# EAGLE design P20 Relay Board V1 (EAGLE 9.5.0)

## Sheet 1 of 3
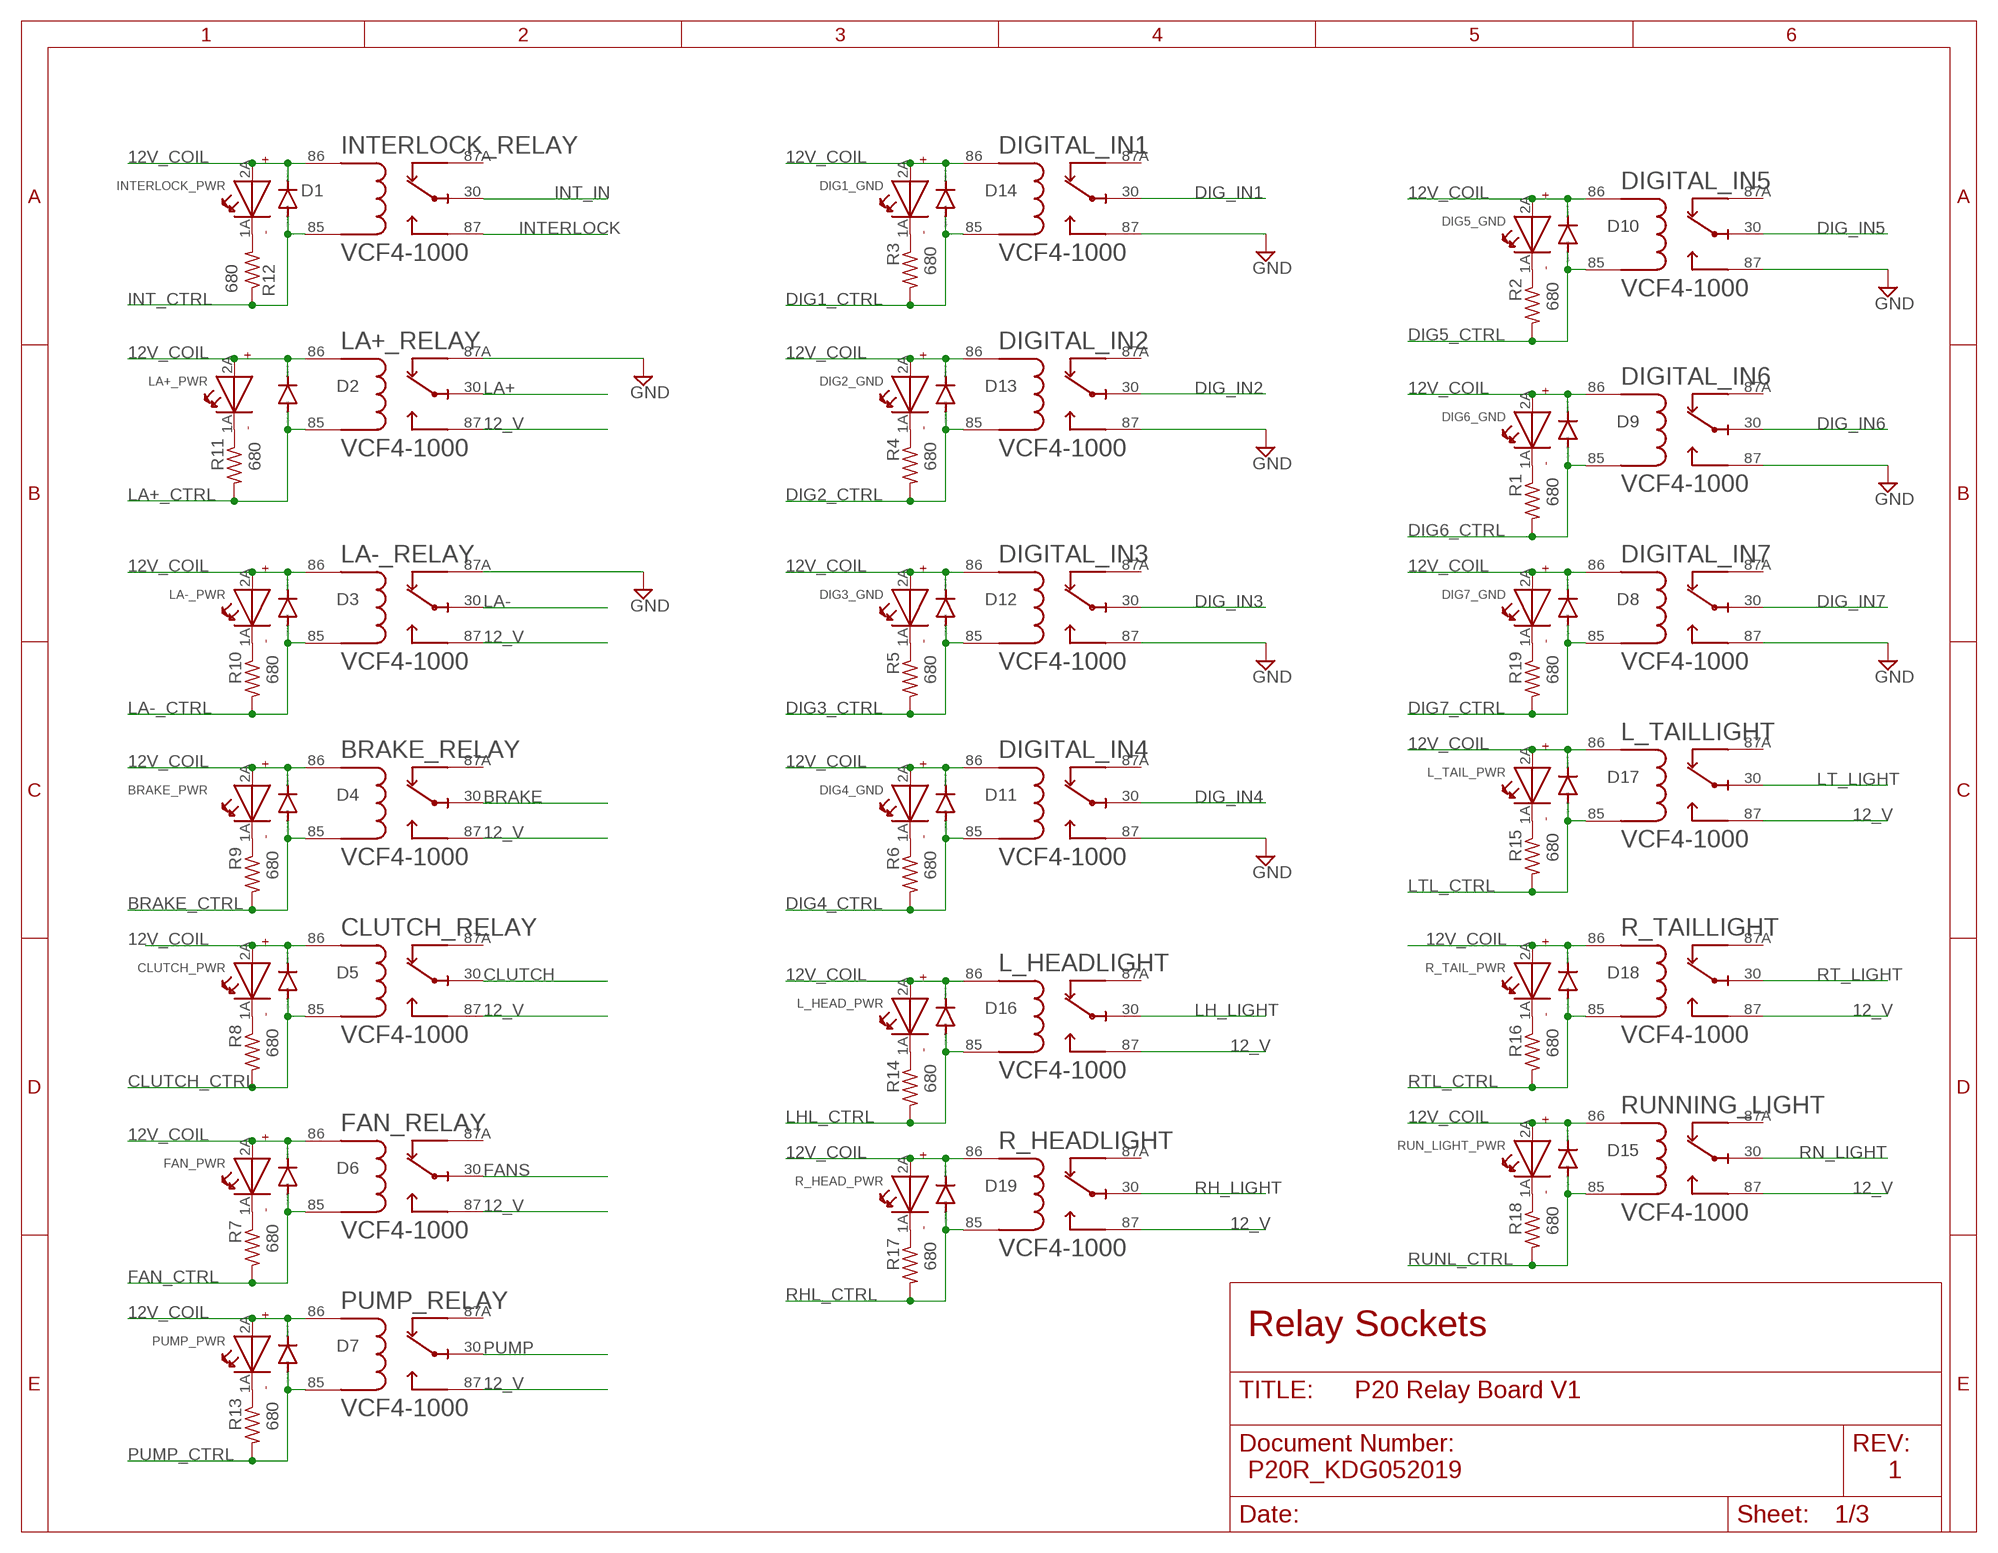
[diagram p0: schematic, sheet 1]

### Parts
BRAKE_PWR  WL-TMRW151033BS03000-B  [LED-3MM-ROUND]
BRAKE_RELAY  VCF4-1000  [TE_VCF4-1000]
CLUTCH_PWR  WL-TMRW151033BS03000-B  [LED-3MM-ROUND]
CLUTCH_RELAY  VCF4-1000  [TE_VCF4-1000]
D1  1N4004  [DO41-10]
D2  1N4004  [DO41-10]
D3  1N4004  [DO41-10]
D4  1N4004  [DO41-10]
D5  1N4004  [DO41-10]
D6  1N4004  [DO41-10]
D7  1N4004  [DO41-10]
D8  1N4004  [DO41-10]
D9  1N4004  [DO41-10]
D10  1N4004  [DO41-10]
D11  1N4004  [DO41-10]
D12  1N4004  [DO41-10]
D13  1N4004  [DO41-10]
D14  1N4004  [DO41-10]
D15  1N4004  [DO41-10]
D16  1N4004  [DO41-10]
D17  1N4004  [DO41-10]
D18  1N4004  [DO41-10]
D19  1N4004  [DO41-10]
DIG1_GND  WL-TMRW151033BS03000-B  [LED-3MM-ROUND]
DIG2_GND  WL-TMRW151033BS03000-B  [LED-3MM-ROUND]
DIG3_GND  WL-TMRW151033BS03000-B  [LED-3MM-ROUND]
DIG4_GND  WL-TMRW151033BS03000-B  [LED-3MM-ROUND]
DIG5_GND  WL-TMRW151033BS03000-B  [LED-3MM-ROUND]
DIG6_GND  WL-TMRW151033BS03000-B  [LED-3MM-ROUND]
DIG7_GND  WL-TMRW151033BS03000-B  [LED-3MM-ROUND]
DIGITAL_IN1  VCF4-1000  [TE_VCF4-1000]
DIGITAL_IN2  VCF4-1000  [TE_VCF4-1000]
DIGITAL_IN3  VCF4-1000  [TE_VCF4-1000]
DIGITAL_IN4  VCF4-1000  [TE_VCF4-1000]
DIGITAL_IN5  VCF4-1000  [TE_VCF4-1000]
DIGITAL_IN6  VCF4-1000  [TE_VCF4-1000]
DIGITAL_IN7  VCF4-1000  [TE_VCF4-1000]
FAN_PWR  WL-TMRW151033BS03000-B  [LED-3MM-ROUND]
FAN_RELAY  VCF4-1000  [TE_VCF4-1000]
INTERLOCK_PWR  WL-TMRW151033BS03000-B  [LED-3MM-ROUND]
INTERLOCK_RELAY  VCF4-1000  [TE_VCF4-1000]
L_HEAD_PWR  WL-TMRW151033BS03000-B  [LED-3MM-ROUND]
L_HEADLIGHT  VCF4-1000  [TE_VCF4-1000]
L_TAIL_PWR  WL-TMRW151033BS03000-B  [LED-3MM-ROUND]
L_TAILLIGHT  VCF4-1000  [TE_VCF4-1000]
LA+_PWR  WL-TMRW151033BS03000-B  [LED-3MM-ROUND]
LA+_RELAY  VCF4-1000  [TE_VCF4-1000]
LA-_PWR  WL-TMRW151033BS03000-B  [LED-3MM-ROUND]
LA-_RELAY  VCF4-1000  [TE_VCF4-1000]
PUMP_PWR  WL-TMRW151033BS03000-B  [LED-3MM-ROUND]
PUMP_RELAY  VCF4-1000  [TE_VCF4-1000]
R1  680  R-US_0207/10  [0207/10]
R2  680  R-US_0207/10  [0207/10]
R3  680  R-US_0207/10  [0207/10]
R4  680  R-US_0207/10  [0207/10]
R5  680  R-US_0207/10  [0207/10]
R6  680  R-US_0207/10  [0207/10]
R7  680  R-US_0207/10  [0207/10]
R8  680  R-US_0207/10  [0207/10]
R9  680  R-US_0207/10  [0207/10]
R10  680  R-US_0207/10  [0207/10]
R11  680  R-US_0207/10  [0207/10]
R12  680  R-US_0207/10  [0207/10]
R13  680  R-US_0207/10  [0207/10]
R14  680  R-US_0207/10  [0207/10]
R15  680  R-US_0207/10  [0207/10]
R16  680  R-US_0207/10  [0207/10]
R17  680  R-US_0207/10  [0207/10]
R18  680  R-US_0207/10  [0207/10]
R19  680  R-US_0207/10  [0207/10]
R_HEAD_PWR  WL-TMRW151033BS03000-B  [LED-3MM-ROUND]
R_HEADLIGHT  VCF4-1000  [TE_VCF4-1000]
R_TAIL_PWR  WL-TMRW151033BS03000-B  [LED-3MM-ROUND]
R_TAILLIGHT  VCF4-1000  [TE_VCF4-1000]
RUN_LIGHT_PWR  WL-TMRW151033BS03000-B  [LED-3MM-ROUND]
RUNNING_LIGHT  VCF4-1000  [TE_VCF4-1000]

### Nets
12_V: BRAKE_RELAY.87 CLUTCH_RELAY.87 FAN_RELAY.87 L_HEADLIGHT.87 L_TAILLIGHT.87 LA+_RELAY.87 LA-_RELAY.87 PUMP_RELAY.87 R_HEADLIGHT.87 R_TAILLIGHT.87 RUNNING_LIGHT.87 ; also sheet 2
12V_COIL: BRAKE_PWR.2A(+) BRAKE_RELAY.86 CLUTCH_PWR.2A(+) CLUTCH_RELAY.86 D1.C D2.C D3.C D4.C D5.C D6.C D7.C D8.C D9.C D10.C D11.C D12.C D13.C D14.C D15.C D16.C D17.C D18.C D19.C DIG1_GND.2A(+) DIG2_GND.2A(+) DIG3_GND.2A(+) DIG4_GND.2A(+) DIG5_GND.2A(+) DIG6_GND.2A(+) DIG7_GND.2A(+) DIGITAL_IN1.86 DIGITAL_IN2.86 DIGITAL_IN3.86 DIGITAL_IN4.86 DIGITAL_IN5.86 DIGITAL_IN6.86 DIGITAL_IN7.86 FAN_PWR.2A(+) FAN_RELAY.86 INTERLOCK_PWR.2A(+) INTERLOCK_RELAY.86 L_HEAD_PWR.2A(+) L_HEADLIGHT.86 L_TAIL_PWR.2A(+) L_TAILLIGHT.86 LA+_PWR.2A(+) LA+_RELAY.86 LA-_PWR.2A(+) LA-_RELAY.86 PUMP_PWR.2A(+) PUMP_RELAY.86 R_HEAD_PWR.2A(+) R_HEADLIGHT.86 R_TAIL_PWR.2A(+) R_TAILLIGHT.86 RUN_LIGHT_PWR.2A(+) RUNNING_LIGHT.86 ; also sheet 2
BRAKE: BRAKE_RELAY.30 ; also sheet 2
BRAKE_CTRL: BRAKE_RELAY.85 D4.A R9.2 ; also sheet 2
CLUTCH: CLUTCH_RELAY.30 ; also sheet 2
CLUTCH_CTRL: CLUTCH_RELAY.85 D5.A R8.2 ; also sheet 2
DIG1_CTRL: D14.A DIGITAL_IN1.85 R3.2 ; also sheet 2
DIG2_CTRL: D13.A DIGITAL_IN2.85 R4.2 ; also sheet 2
DIG3_CTRL: D12.A DIGITAL_IN3.85 R5.2 ; also sheet 2
DIG4_CTRL: D11.A DIGITAL_IN4.85 R6.2 ; also sheet 2
DIG5_CTRL: D10.A DIGITAL_IN5.85 R2.2 ; also sheet 2
DIG6_CTRL: D9.A DIGITAL_IN6.85 R1.2 ; also sheet 2
DIG7_CTRL: D8.A DIGITAL_IN7.85 R19.2 ; also sheet 2
DIG_IN1: DIGITAL_IN1.30 ; also sheet 2
DIG_IN2: DIGITAL_IN2.30 ; also sheet 2
DIG_IN3: DIGITAL_IN3.30 ; also sheet 2
DIG_IN4: DIGITAL_IN4.30 ; also sheet 2
DIG_IN5: DIGITAL_IN5.30 ; also sheet 2
DIG_IN6: DIGITAL_IN6.30 ; also sheet 2
DIG_IN7: DIGITAL_IN7.30 ; also sheet 2
FAN_CTRL: D6.A FAN_RELAY.85 R7.2 ; also sheet 2
FANS: FAN_RELAY.30 ; also sheet 2
GND: DIGITAL_IN1.87 DIGITAL_IN2.87 DIGITAL_IN3.87 DIGITAL_IN4.87 DIGITAL_IN5.87 DIGITAL_IN6.87 DIGITAL_IN7.87 LA+_RELAY.87A LA-_RELAY.87A ; also sheet 2
INT_CTRL: D1.A INTERLOCK_RELAY.85 R12.1 ; also sheet 2
INT_IN: INTERLOCK_RELAY.30 ; also sheet 2
INTERLOCK: INTERLOCK_RELAY.87 ; also sheet 2
LA+: LA+_RELAY.30 ; also sheet 2
LA+_CTRL: D2.A LA+_RELAY.85 R11.2 ; also sheet 2
LA-: LA-_RELAY.30 ; also sheet 2
LA-_CTRL: D3.A LA-_RELAY.85 R10.2 ; also sheet 2
LH_LIGHT: L_HEADLIGHT.30 ; also sheet 2
LHL_CTRL: D16.A L_HEADLIGHT.85 R14.2 ; also sheet 2
LT_LIGHT: L_TAILLIGHT.30 ; also sheet 2
LTL_CTRL: D17.A L_TAILLIGHT.85 R15.2 ; also sheet 2
N$2: DIG7_GND.1A(-) R19.1
N$4: DIG5_GND.1A(-) R2.1
N$5: DIG1_GND.1A(-) R3.1
N$6: DIG2_GND.1A(-) R4.1
N$7: DIG3_GND.1A(-) R5.1
N$8: DIG4_GND.1A(-) R6.1
N$9: FAN_PWR.1A(-) R7.1
N$10: CLUTCH_PWR.1A(-) R8.1
N$11: BRAKE_PWR.1A(-) R9.1
N$12: LA-_PWR.1A(-) R10.1
N$13: LA+_PWR.1A(-) R11.1
N$14: INTERLOCK_PWR.1A(-) R12.2
N$15: PUMP_PWR.1A(-) R13.1
N$16: L_HEAD_PWR.1A(-) R14.1
N$17: L_TAIL_PWR.1A(-) R15.1
N$19: R17.1 R_HEAD_PWR.1A(-)
N$33: R16.1 R_TAIL_PWR.1A(-)
N$34: R18.1 RUN_LIGHT_PWR.1A(-)
N$36: DIG6_GND.1A(-) R1.1
PUMP: PUMP_RELAY.30 ; also sheet 2
PUMP_CTRL: D7.A PUMP_RELAY.85 R13.2 ; also sheet 2
RH_LIGHT: R_HEADLIGHT.30 ; also sheet 2
RHL_CTRL: D19.A R17.2 R_HEADLIGHT.85 ; also sheet 2
RN_LIGHT: RUNNING_LIGHT.30 ; also sheet 2
RT_LIGHT: R_TAILLIGHT.30 ; also sheet 2
RTL_CTRL: D18.A R16.2 R_TAILLIGHT.85 ; also sheet 2
RUNL_CTRL: D15.A R18.2 RUNNING_LIGHT.85 ; also sheet 2
Unconnected: BRAKE_RELAY.87A CLUTCH_RELAY.87A DIGITAL_IN1.87A DIGITAL_IN2.87A DIGITAL_IN3.87A DIGITAL_IN4.87A DIGITAL_IN5.87A DIGITAL_IN6.87A DIGITAL_IN7.87A FAN_RELAY.87A INTERLOCK_RELAY.87A L_HEADLIGHT.87A L_TAILLIGHT.87A PUMP_RELAY.87A R_HEADLIGHT.87A R_TAILLIGHT.87A RUNNING_LIGHT.87A

### Notes on the sheet
- Relay Sockets
- P20R_KDG052019 | 1

## Sheet 2 of 3
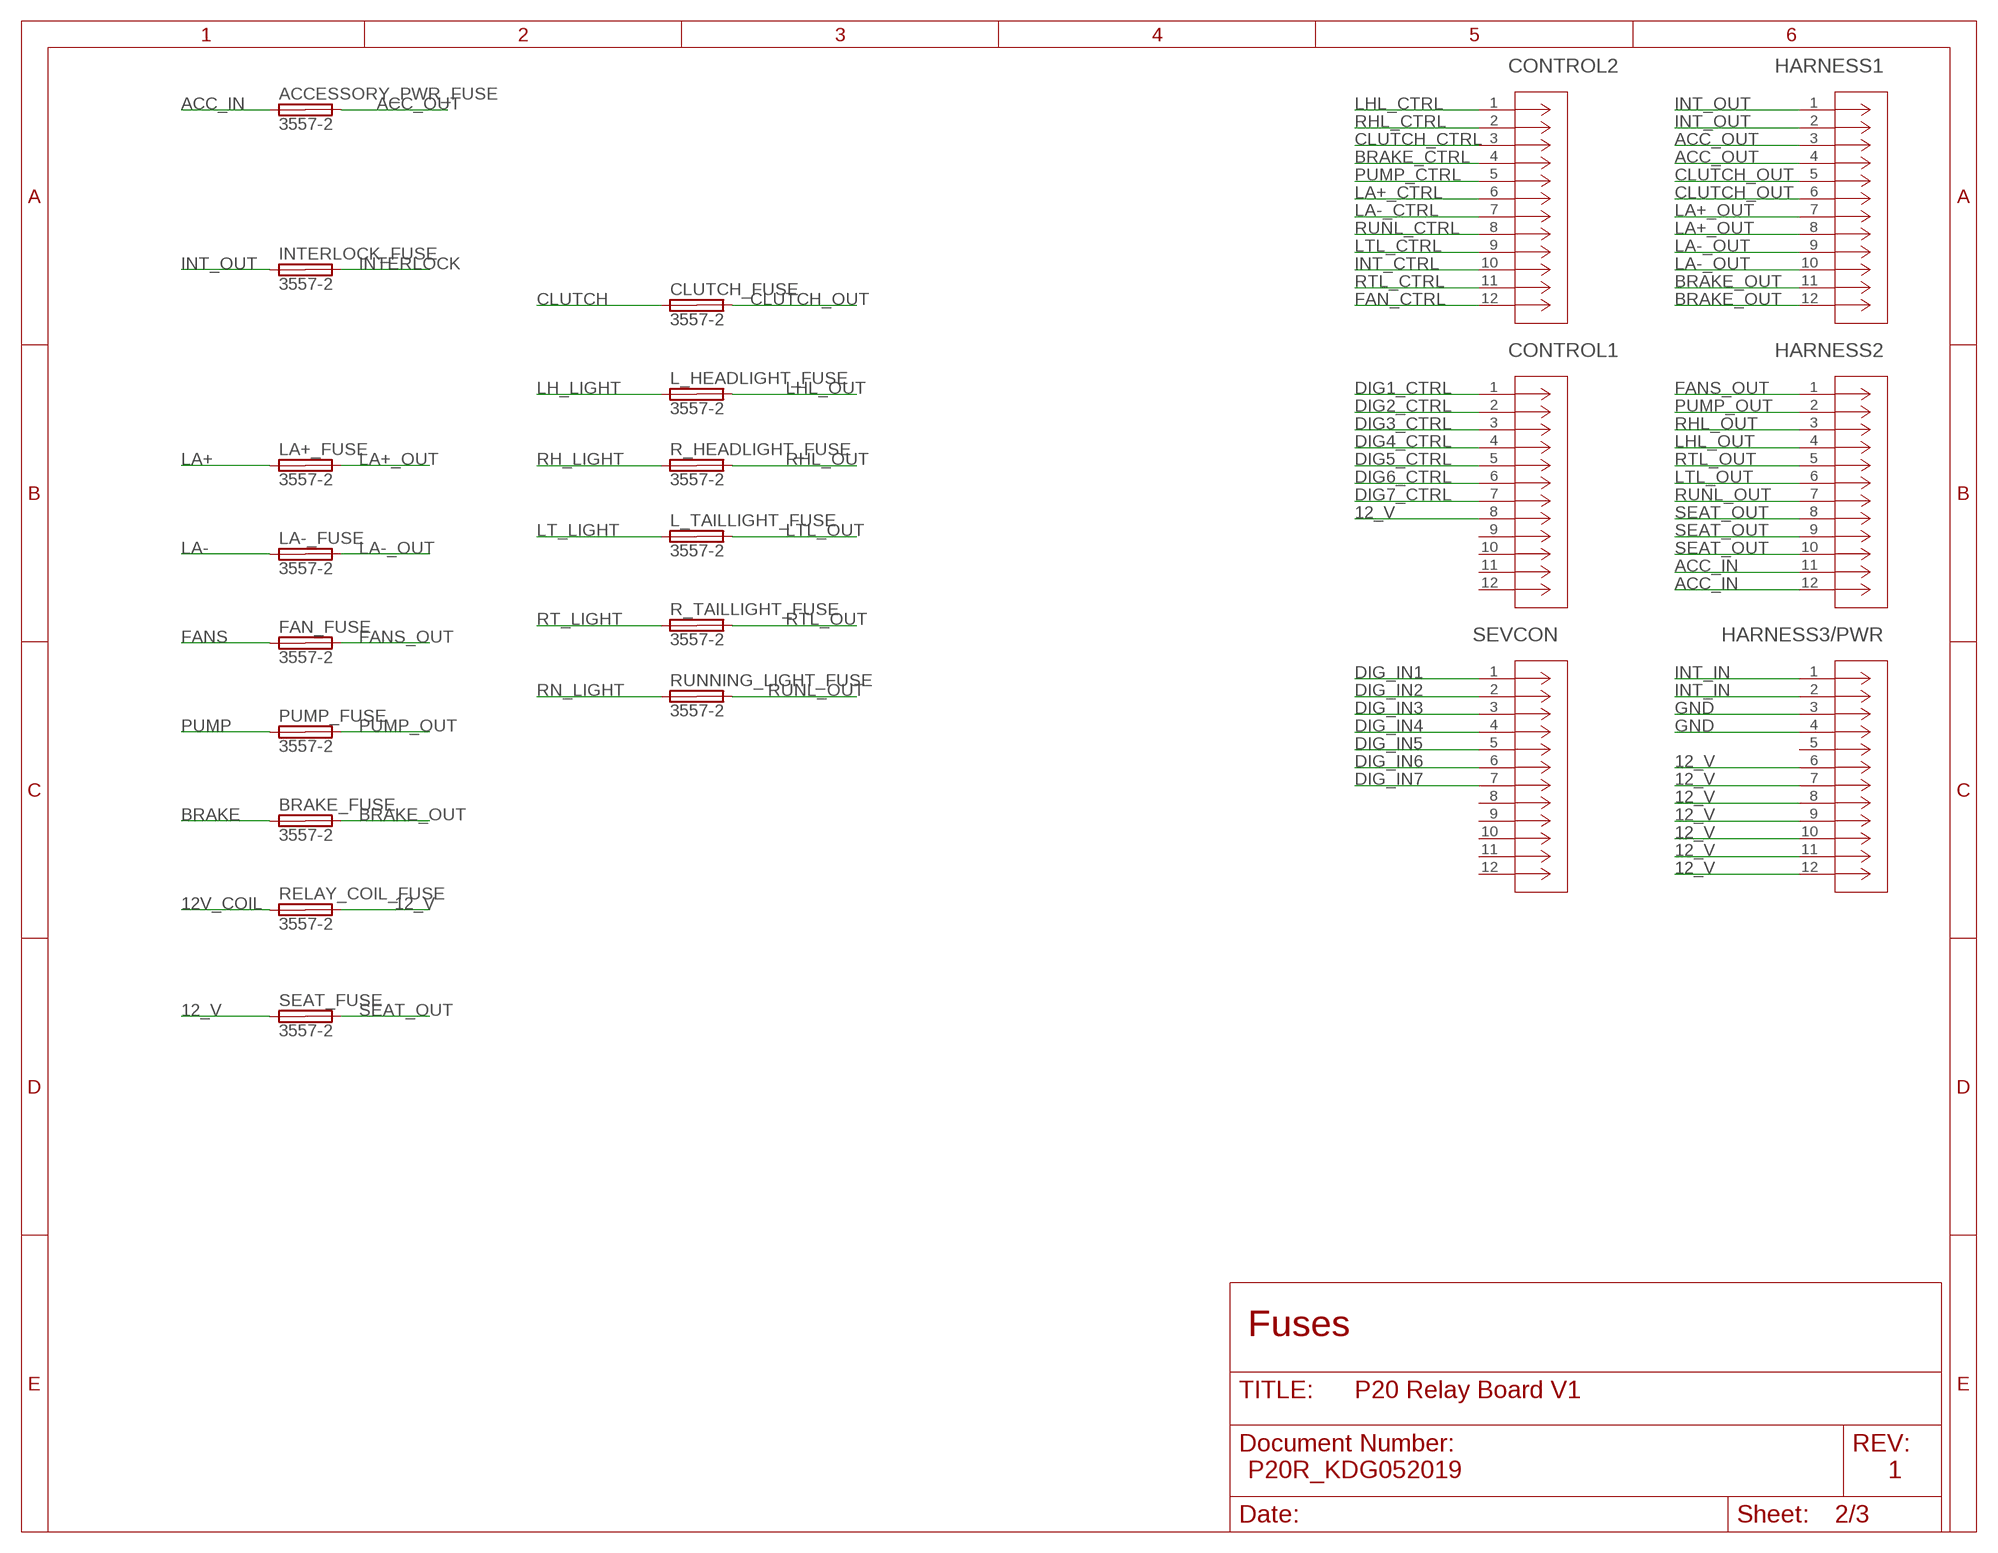
[diagram p1: schematic, sheet 2]

### Parts
ACCESSORY_PWR_FUSE  3557-2  [FUSE_3557-2]
BRAKE_FUSE  3557-2  [FUSE_3557-2]
CLUTCH_FUSE  3557-2  [FUSE_3557-2]
CONTROL1  DTM13-12PA  [CONN12_DTM13-12PA]
CONTROL2  DTM13-12PA  [CONN12_DTM13-12PA]
FAN_FUSE  3557-2  [FUSE_3557-2]
HARNESS1  DTM13-12PA  [CONN12_DTM13-12PA]
HARNESS2  DTM13-12PA  [CONN12_DTM13-12PA]
HARNESS3/PWR  DTM13-12PA  [CONN12_DTM13-12PA]
INTERLOCK_FUSE  3557-2  [FUSE_3557-2]
L_HEADLIGHT_FUSE  3557-2  [FUSE_3557-2]
L_TAILLIGHT_FUSE  3557-2  [FUSE_3557-2]
LA+_FUSE  3557-2  [FUSE_3557-2]
LA-_FUSE  3557-2  [FUSE_3557-2]
PUMP_FUSE  3557-2  [FUSE_3557-2]
R_HEADLIGHT_FUSE  3557-2  [FUSE_3557-2]
R_TAILLIGHT_FUSE  3557-2  [FUSE_3557-2]
RELAY_COIL_FUSE  3557-2  [FUSE_3557-2]
RUNNING_LIGHT_FUSE  3557-2  [FUSE_3557-2]
SEAT_FUSE  3557-2  [FUSE_3557-2]
SEVCON  DTM13-12PA  [CONN12_DTM13-12PA]

### Nets
12_V: CONTROL1.8 HARNESS3/PWR.6 HARNESS3/PWR.7 HARNESS3/PWR.8 HARNESS3/PWR.9 HARNESS3/PWR.10 HARNESS3/PWR.11 HARNESS3/PWR.12 RELAY_COIL_FUSE.3(2A) SEAT_FUSE.1(1A) ; also sheet 1
12V_COIL: RELAY_COIL_FUSE.1(1A) ; also sheet 1
ACC_IN: ACCESSORY_PWR_FUSE.1(1A) HARNESS2.11 HARNESS2.12
ACC_OUT: ACCESSORY_PWR_FUSE.3(2A) HARNESS1.3 HARNESS1.4
BRAKE: BRAKE_FUSE.1(1A) ; also sheet 1
BRAKE_CTRL: CONTROL2.4 ; also sheet 1
BRAKE_OUT: BRAKE_FUSE.3(2A) HARNESS1.11 HARNESS1.12
CLUTCH: CLUTCH_FUSE.1(1A) ; also sheet 1
CLUTCH_CTRL: CONTROL2.3 ; also sheet 1
CLUTCH_OUT: CLUTCH_FUSE.3(2A) HARNESS1.5 HARNESS1.6
DIG1_CTRL: CONTROL1.1 ; also sheet 1
DIG2_CTRL: CONTROL1.2 ; also sheet 1
DIG3_CTRL: CONTROL1.3 ; also sheet 1
DIG4_CTRL: CONTROL1.4 ; also sheet 1
DIG5_CTRL: CONTROL1.5 ; also sheet 1
DIG6_CTRL: CONTROL1.6 ; also sheet 1
DIG7_CTRL: CONTROL1.7 ; also sheet 1
DIG_IN1: SEVCON.1 ; also sheet 1
DIG_IN2: SEVCON.2 ; also sheet 1
DIG_IN3: SEVCON.3 ; also sheet 1
DIG_IN4: SEVCON.4 ; also sheet 1
DIG_IN5: SEVCON.5 ; also sheet 1
DIG_IN6: SEVCON.6 ; also sheet 1
DIG_IN7: SEVCON.7 ; also sheet 1
FAN_CTRL: CONTROL2.12 ; also sheet 1
FANS: FAN_FUSE.1(1A) ; also sheet 1
FANS_OUT: FAN_FUSE.3(2A) HARNESS2.1
GND: HARNESS3/PWR.3 HARNESS3/PWR.4 ; also sheet 1
INT_CTRL: CONTROL2.10 ; also sheet 1
INT_IN: HARNESS3/PWR.1 HARNESS3/PWR.2 ; also sheet 1
INT_OUT: HARNESS1.1 HARNESS1.2 INTERLOCK_FUSE.1(1A)
INTERLOCK: INTERLOCK_FUSE.3(2A) ; also sheet 1
LA+: LA+_FUSE.1(1A) ; also sheet 1
LA+_CTRL: CONTROL2.6 ; also sheet 1
LA+_OUT: HARNESS1.7 HARNESS1.8 LA+_FUSE.3(2A)
LA-: LA-_FUSE.1(1A) ; also sheet 1
LA-_CTRL: CONTROL2.7 ; also sheet 1
LA-_OUT: HARNESS1.9 HARNESS1.10 LA-_FUSE.3(2A)
LH_LIGHT: L_HEADLIGHT_FUSE.1(1A) ; also sheet 1
LHL_CTRL: CONTROL2.1 ; also sheet 1
LHL_OUT: HARNESS2.4 L_HEADLIGHT_FUSE.3(2A)
LT_LIGHT: L_TAILLIGHT_FUSE.1(1A) ; also sheet 1
LTL_CTRL: CONTROL2.9 ; also sheet 1
LTL_OUT: HARNESS2.6 L_TAILLIGHT_FUSE.3(2A)
PUMP: PUMP_FUSE.1(1A) ; also sheet 1
PUMP_CTRL: CONTROL2.5 ; also sheet 1
PUMP_OUT: HARNESS2.2 PUMP_FUSE.3(2A)
RH_LIGHT: R_HEADLIGHT_FUSE.1(1A) ; also sheet 1
RHL_CTRL: CONTROL2.2 ; also sheet 1
RHL_OUT: HARNESS2.3 R_HEADLIGHT_FUSE.3(2A)
RN_LIGHT: RUNNING_LIGHT_FUSE.1(1A) ; also sheet 1
RT_LIGHT: R_TAILLIGHT_FUSE.1(1A) ; also sheet 1
RTL_CTRL: CONTROL2.11 ; also sheet 1
RTL_OUT: HARNESS2.5 R_TAILLIGHT_FUSE.3(2A)
RUNL_CTRL: CONTROL2.8 ; also sheet 1
RUNL_OUT: HARNESS2.7 RUNNING_LIGHT_FUSE.3(2A)
SEAT_OUT: HARNESS2.8 HARNESS2.9 HARNESS2.10 SEAT_FUSE.3(2A)
Unconnected: ACCESSORY_PWR_FUSE.2(1B) ACCESSORY_PWR_FUSE.4(2B) BRAKE_FUSE.2(1B) BRAKE_FUSE.4(2B) CLUTCH_FUSE.2(1B) CLUTCH_FUSE.4(2B) CONTROL1.9 CONTROL1.10 CONTROL1.11 CONTROL1.12 FAN_FUSE.2(1B) FAN_FUSE.4(2B) HARNESS3/PWR.5 INTERLOCK_FUSE.2(1B) INTERLOCK_FUSE.4(2B) L_HEADLIGHT_FUSE.2(1B) L_HEADLIGHT_FUSE.4(2B) L_TAILLIGHT_FUSE.2(1B) L_TAILLIGHT_FUSE.4(2B) LA+_FUSE.2(1B) LA+_FUSE.4(2B) LA-_FUSE.2(1B) LA-_FUSE.4(2B) PUMP_FUSE.2(1B) PUMP_FUSE.4(2B) R_HEADLIGHT_FUSE.2(1B) R_HEADLIGHT_FUSE.4(2B) R_TAILLIGHT_FUSE.2(1B) R_TAILLIGHT_FUSE.4(2B) RELAY_COIL_FUSE.2(1B) RELAY_COIL_FUSE.4(2B) RUNNING_LIGHT_FUSE.2(1B) RUNNING_LIGHT_FUSE.4(2B) SEAT_FUSE.2(1B) SEAT_FUSE.4(2B) SEVCON.8 SEVCON.9 SEVCON.10 SEVCON.11 SEVCON.12

### Notes on the sheet
- Fuses
- P20R_KDG052019 | 1

## Sheet 3 of 3
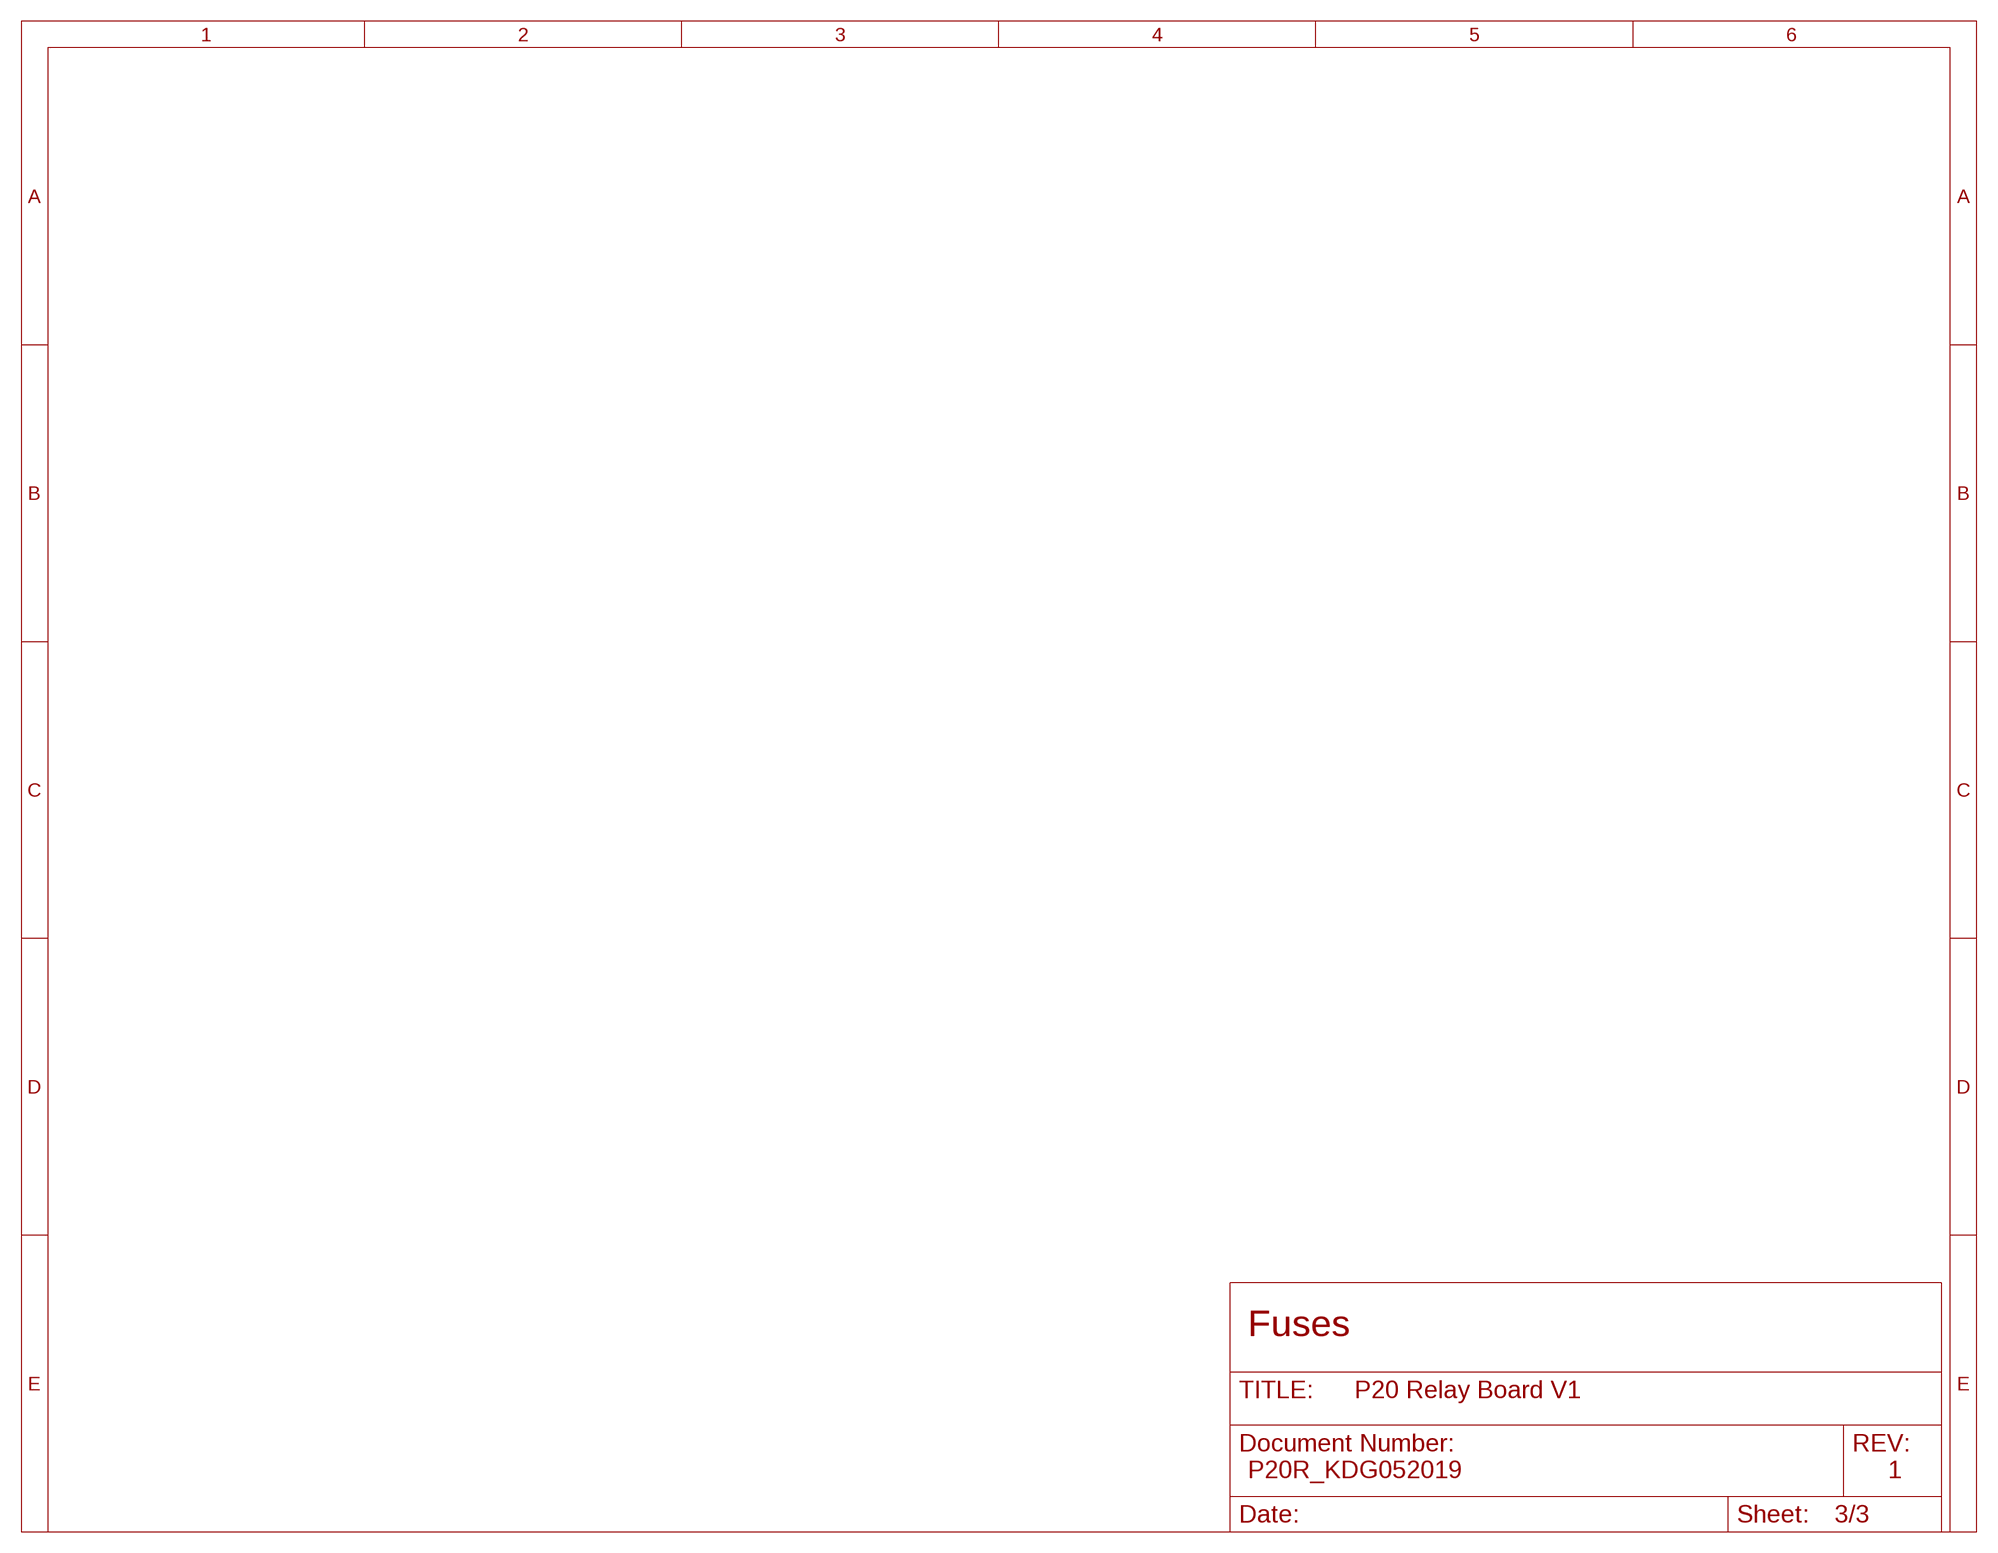
[diagram p2: schematic, sheet 3]

### Notes on the sheet
- Fuses
- P20R_KDG052019 | 1

## Library data of the parts
ACCESSORY_PWR_FUSE BRAKE_FUSE CLUTCH_FUSE FAN_FUSE INTERLOCK_FUSE L_HEADLIGHT_FUSE L_TAILLIGHT_FUSE LA+_FUSE LA-_FUSE PUMP_FUSE R_HEADLIGHT_FUSE R_TAILLIGHT_FUSE RELAY_COIL_FUSE RUNNING_LIGHT_FUSE SEAT_FUSE = UMATT:3557-2: Clip; Auto Clips & Holders; 2-1 Holder For Standard & Low Profile Mini Fuses; AVAILABILITY: Unavailable; DESCRIPTION: Clip; Auto Clips & Holders; 2-1 Holder For Standard & Low Profile Mini Fuses; MF: Keystone; MP: 3557-2; PACKAGE: None; PRICE: None
BRAKE_PWR CLUTCH_PWR DIG1_GND DIG2_GND DIG3_GND DIG4_GND DIG5_GND DIG6_GND DIG7_GND FAN_PWR INTERLOCK_PWR L_HEAD_PWR L_TAIL_PWR LA+_PWR LA-_PWR PUMP_PWR R_HEAD_PWR R_TAIL_PWR RUN_LIGHT_PWR = UMATT:WL-TMRW: WL-TMRW THT mono-color round LED Characteristics Low energy consumption High reliability Low current requirement Fast switching No UV/IR radiation Easy installation Ultra high luminous efficacy Versatile mounting on PC boards With stopper Applications Indicator light Displays Traffic signal light Marker lights Commercial outdoor advertising Energy saving lamp Backlight <http://katalog.we-online.de/media/images/eipal/WL-TMRW_pf2.jpg> Details see: http://katalog.we-online.de/en/led/WL-TMRW?m Updated: 2015-04-10 2015 (C) Wurth Elektronik; DESCRIPTION: LED, 3MM, RED, 2600MCD, 621NM; Bulb Size: T-1 _3mm_; LED Colour: Red; Luminous In; DIGI-KEY_PART_NUMBER: 732-5013-ND; DIGI-KEY_PURCHASE_URL: https://www.digikey.ca/product-detail/en/wurth-electronics-inc/151033RS03000/732-5013-ND/4490003?utm_source=snapeda&utm_medium=aggregator&utm_campaign=symbol; MF: Wurth Electronics; MP: 151033RS03000; PACKAGE: Radial Würth Elektronik
BRAKE_RELAY CLUTCH_RELAY DIGITAL_IN1-DIGITAL_IN7 FAN_RELAY INTERLOCK_RELAY L_HEADLIGHT L_TAILLIGHT LA+_RELAY LA-_RELAY PUMP_RELAY R_HEADLIGHT R_TAILLIGHT RUNNING_LIGHT = UMATT:VCF4-1000: Socket, Relay; PCB, VTF Series, 1 Pole, Quick-Connect, w/o Grounding Provision; COMMENT: 1393310-3; DESCRIPTION: Socket, Relay; PCB, VTF Series, 1 Pole, Quick-Connect, w/o Grounding Provision; DIGI-KEY_PART_NUMBER: PB232-ND; DIGI-KEY_PURCHASE_URL: https://www.digikey.com/product-detail/en/te-connectivity-potter-brumfield-relays/VCF4-1000/PB232-ND/207273?utm_source=snapeda&utm_medium=aggregator&utm_campaign=symbol; MF: TE Connectivity; MP: VCF4-1000; PACKAGE: None; PRODUCT_TYPE: Socket; TE_PURCHASE_URL: https://www.te.com/usa-en/product-1393310-3.html?te_bu=Cor&te_type=disp&te_campaign=seda_glo_cor-seda-global-disp-prtnr-fy19-seda-model-bom-cta_sma-317_1&elqCampaignId=32493
CONTROL1 CONTROL2 HARNESS1 HARNESS2 HARNESS3/PWR SEVCON = UMATT:DTM13-12PA; MANUFACTURER_PART_NUMBER: DTM1312PA; VENDOR: TE Connectivity
D1-D19 = diode:1N4004: DIODE general purpose rectifier, 1 A
R1-R19 = rcl:R-US_: RESISTOR, American symbol; SPICEPREFIX: R

## Board
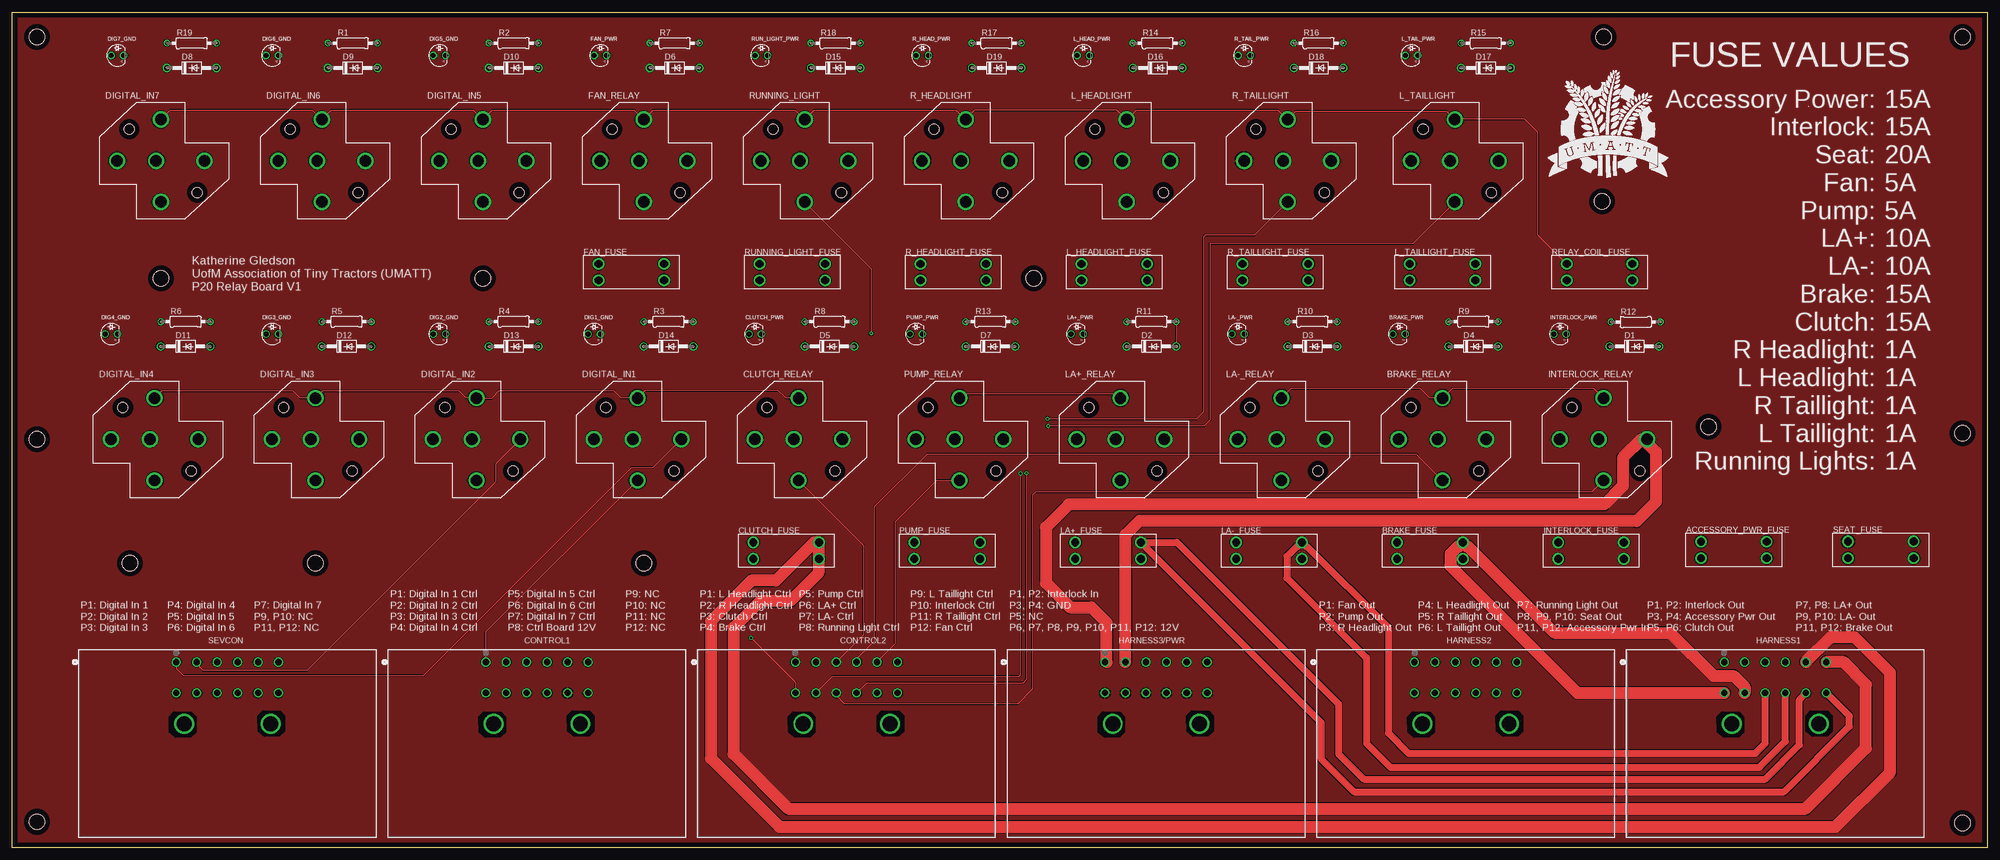
[diagram p3: board, top side]
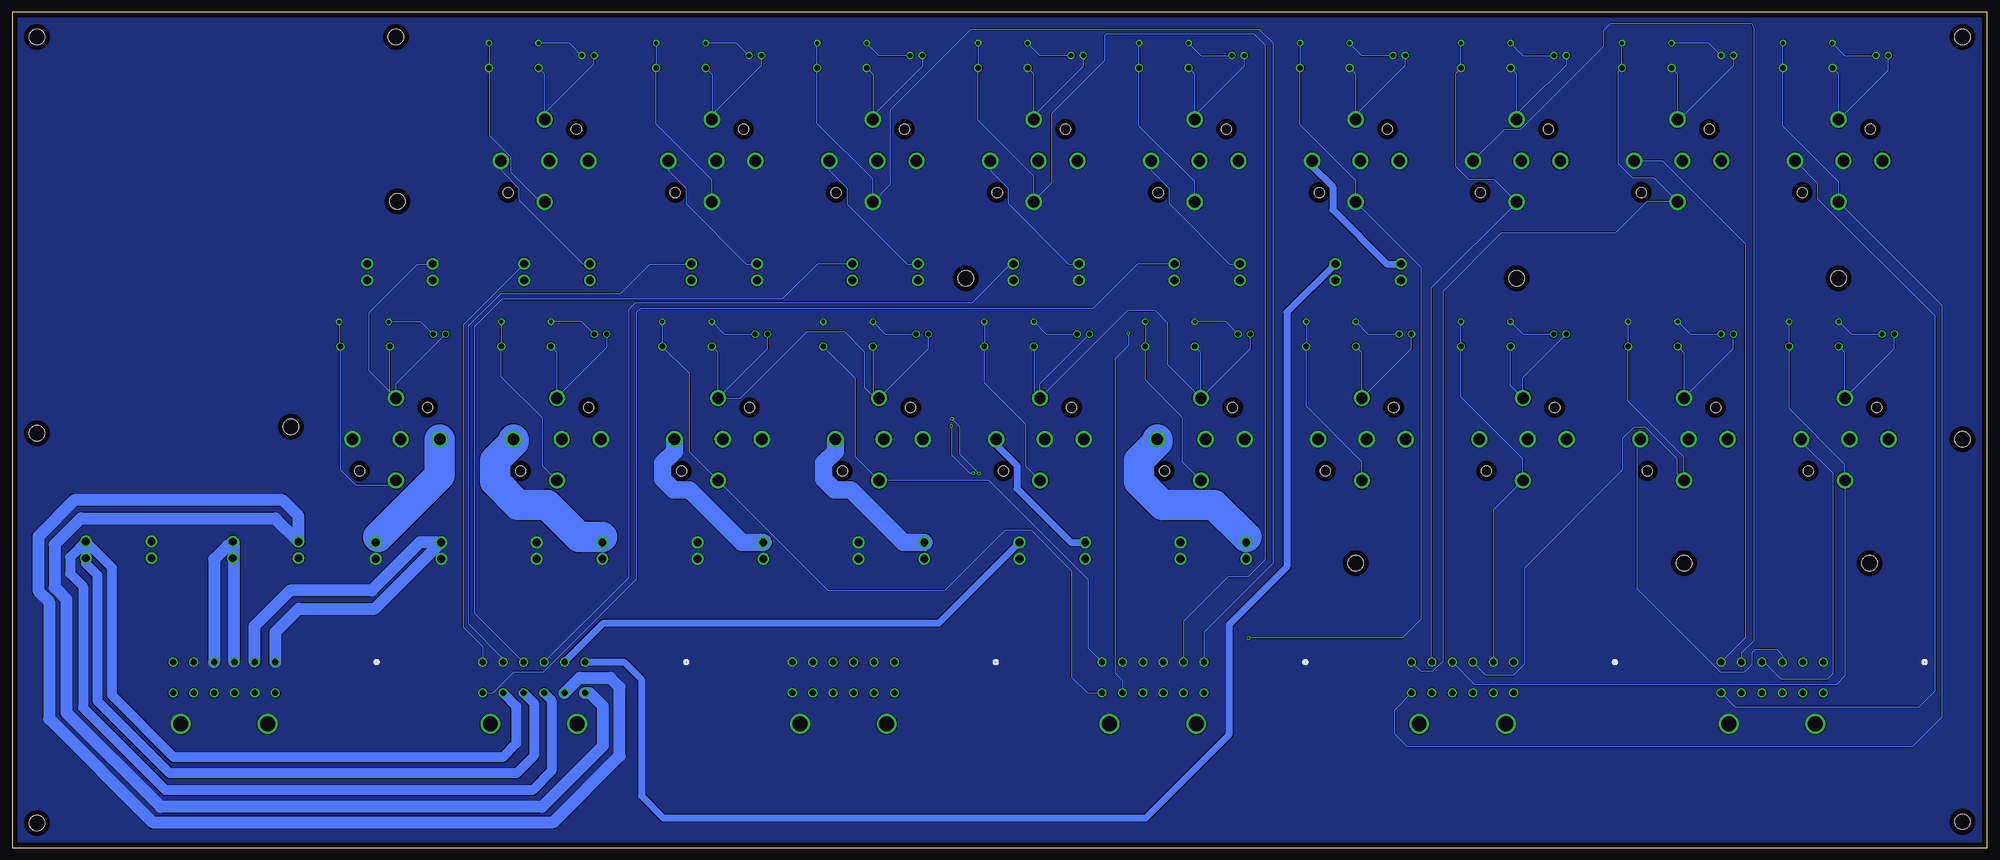
[diagram p4: board, bottom side, seen from below]

Size 405.13 x 171.45 mm. Coordinates in mm from the lower left corner, seen from the top.
Outline: 0,0 0,171.45 405.13,171.45 405.13,0 0,0
Copper layers (1*16): Top 0.035mm / dielectric 1.5mm / Bottom 0.035mm
Design rules "default": minimum track width 6mil, minimum drill 0.35mm, track to track 6mil, track to pad 6mil, pad to pad 6mil, via to via 6mil, smd to smd 6mil, copper to edge 40mil, drill to drill 6mil, minimum pad ring 10mil, minimum via ring 8mil, stop-mask expansion 4mil, vias tented up to drill 0mil, thermal gap 10mil
Holes 3.2 mm at 5.08,5.33 326.14,132.59 5.08,83.82 5.08,166.37 96.52,116.84 30.48,116.84 62.23,58.42 24.13,58.42 129.54,58.42 326.39,166.37 400.05,166.37 400.05,85.09 400.05,5.08 347.98,86.36 209.55,116.84

### Footprints (pad centres in the part's own frame; a part is rotated, then mirrored left to right if it is on the bottom)
FUSE_3557-2 = drill 1.6: 1 -6.735,1.7; 2 -6.735,-1.7; 3 6.735,1.7; 4 6.735,-1.7
LED-3MM-ROUND = drill 1: 1A 1.27,0; 2A -1.27,0
TE_VCF4-1000 = drill 2.337: 30 8.95,0; 85 0,-8.45; 86 0,8.45; 87 -8.95,0; 87A -0.95,0 | hole 2.1: 7.5,-6.5; -6.5,6.5
CONN12_DTM13-12PA = drill 1.245 pad 1.753: 1 20.955,-6.35; 2 16.764,-6.35; 3 12.573,-6.35; 4 8.382,-6.35; 5 4.191,-6.35; 6 0,-6.35; 7 0,0; 8 4.191,0; 9 8.382,0; 10 12.573,0; 11 16.764,0; 12 20.955,0 | drill 3.048 pad 3.048: 13 19.355,6.35; 14 1.575,6.35
DO41-10 = drill 1.118: A 5.08,0; C -5.08,0
0207/10 = drill 0.813 octagon: 1 -5.08,0; 2 5.08,0

### Placement (x,y rotation side)
ACCESSORY_PWR_FUSE  353.14,61.11 0 top
BRAKE_FUSE  290.83,60.96 0 top
BRAKE_PWR  284.48,105.41 0 top
BRAKE_RELAY  293.37,83.82 0 top
CLUTCH_FUSE  158.75,60.96 0 top
CLUTCH_PWR  152.4,105.41 0 top
CLUTCH_RELAY  161.29,83.82 0 top
CONTROL1  118.11,31.75 180 top
CONTROL2  181.61,31.75 180 top
D1  332.74,102.87 0 top
D2  233.68,102.87 0 top
D3  266.7,102.87 0 top
D4  299.72,102.87 0 top
D5  167.64,102.87 0 top
D6  135.89,160.02 0 top
D7  200.66,102.87 0 top
D8  36.83,160.02 0 top
D9  69.85,160.02 0 top
D10  102.87,160.02 0 top
D11  35.56,102.87 0 top
D12  68.58,102.87 0 top
D13  102.87,102.87 0 top
D14  134.62,102.87 0 top
D15  168.91,160.02 0 top
D16  234.95,160.02 0 top
D17  302.26,160.02 0 top
D18  267.97,160.02 0 top
D19  201.93,160.02 0 top
DIG1_GND  119.38,105.41 0 top
DIG2_GND  87.63,105.41 0 top
DIG3_GND  53.34,105.41 0 top
DIG4_GND  20.32,105.41 0 top
DIG5_GND  87.63,162.56 0 top
DIG6_GND  53.34,162.56 0 top
DIG7_GND  21.59,162.56 0 top
DIGITAL_IN1  128.27,83.82 0 top
DIGITAL_IN2  95.25,83.82 0 top
DIGITAL_IN3  62.23,83.82 0 top
DIGITAL_IN4  29.21,83.82 0 top
DIGITAL_IN5  96.52,140.97 0 top
DIGITAL_IN6  63.5,140.97 0 top
DIGITAL_IN7  30.48,140.97 0 top
FAN_FUSE  127,118.11 0 top
FAN_PWR  120.65,162.56 0 top
FAN_RELAY  129.54,140.97 0 top
HARNESS1  372.11,31.75 180 top
HARNESS2  308.61,31.75 180 top
HARNESS3/PWR  245.11,31.75 180 top
INTERLOCK_FUSE  323.85,60.96 0 top
INTERLOCK_PWR  317.5,105.41 0 top
INTERLOCK_RELAY  326.39,83.82 0 top
L_HEAD_PWR  219.71,162.56 0 top
L_HEADLIGHT  228.6,140.97 0 top
L_HEADLIGHT_FUSE  226.06,118.11 0 top
L_TAIL_PWR  287.02,162.56 0 top
L_TAILLIGHT  295.91,140.97 0 top
L_TAILLIGHT_FUSE  293.37,118.11 0 top
LA+_FUSE  224.79,60.96 0 top
LA+_PWR  218.44,105.41 0 top
LA+_RELAY  227.33,83.82 0 top
LA-_FUSE  257.81,60.96 0 top
LA-_PWR  251.46,105.41 0 top
LA-_RELAY  260.35,83.82 0 top
PUMP_FUSE  191.77,60.96 0 top
PUMP_PWR  185.42,105.41 0 top
PUMP_RELAY  194.31,83.82 0 top
R1  69.85,165.1 0 top
R2  102.87,165.1 0 top
R3  134.62,107.95 0 top
R4  102.87,107.95 0 top
R5  68.58,107.95 0 top
R6  35.56,107.95 0 top
R7  135.89,165.1 0 top
R8  167.64,107.95 0 top
R9  299.72,107.95 0 top
R10  266.7,107.95 0 top
R11  233.68,107.95 0 top
R12  332.99,107.9 180 top
R13  200.66,107.95 0 top
R14  234.95,165.1 0 top
R15  302.26,165.1 0 top
R16  267.97,165.1 0 top
R17  201.93,165.1 0 top
R18  168.91,165.1 0 top
R19  36.83,165.1 0 top
R_HEAD_PWR  186.69,162.56 0 top
R_HEADLIGHT  195.58,140.97 0 top
R_HEADLIGHT_FUSE  193.04,118.11 0 top
R_TAIL_PWR  252.73,162.56 0 top
R_TAILLIGHT  261.62,140.97 0 top
R_TAILLIGHT_FUSE  259.08,118.11 0 top
RELAY_COIL_FUSE  325.6,118.11 0 top
RUN_LIGHT_PWR  153.67,162.56 0 top
RUNNING_LIGHT  162.56,140.97 0 top
RUNNING_LIGHT_FUSE  160.02,118.11 0 top
SEAT_FUSE  383.29,61.14 0 top
SEVCON  54.61,31.75 180 top

### Tracks (layer width: path | path; a pad name or v marks a point on that pad's centre or on a via)
12_V
  pour Top: 0.25,170.94 405.13,170.94 405.13,0.25 0.25,0.25
12V_COIL
  Top 0.254: PUMP_RELAY.86 195.17,93.13 226.47,93.13 LA+_RELAY.86 | INTERLOCK_RELAY.86 324.43,94.23 295.4,94.23 293.44,92.27 BRAKE_RELAY.86 290.76,92.27 288.8,94.23 262.31,94.23 LA-_RELAY.86 | CLUTCH_RELAY.86 158.68,92.27 157.1,93.85 129.85,93.85 DIGITAL_IN1.86 124.9,92.27 123.44,93.73 99.82,93.73 98.3,92.2 95.32,92.2 DIGITAL_IN2.86 93.15,92.27 91.69,93.73 63.69,93.73 DIGITAL_IN3.86 59.11,92.27 57.66,93.73 30.67,93.73 DIGITAL_IN4.86 | DIGITAL_IN7.86 32.44,151.38 61.54,151.38 DIGITAL_IN6.86 65.46,151.38 94.56,151.38 DIGITAL_IN5.86 98.48,151.38 127.58,151.38 FAN_RELAY.86 131.5,151.38 160.6,151.38 RUNNING_LIGHT.86 164.52,151.38 193.62,151.38 R_HEADLIGHT.86 195.58,149.61 197.36,151.38 226.64,151.38 L_HEADLIGHT.86 230.56,151.38 259.66,151.38 R_TAILLIGHT.86 263.33,151.13 294.2,151.13 295.82,149.51 | 295.82,149.51 L_TAILLIGHT.86 | RELAY_COIL_FUSE.1 312.93,125.75 312.93,146.81 310.23,149.51 295.82,149.51
  Bottom 0.254: INTERLOCK_RELAY.86 327.66,93.54 D1.C | INTERLOCK_RELAY.86 326.39,95.25 INTERLOCK_PWR.2A | BRAKE_RELAY.86 293.37,92.76 | 293.37,92.76 293.37,101.6 D4.C | BRAKE_PWR.2A 283.21,102.64 293.09,92.76 293.37,92.76 | LA-_RELAY.86 260.35,101.6 D3.C | LA-_RELAY.86 250.19,102.43 LA-_PWR.2A | D2.C 228.6,93.54 227.42,92.36 | 227.42,92.36 LA+_RELAY.86 217.17,102.43 LA+_PWR.2A | D7.C 195.58,93.54 PUMP_RELAY.86 | PUMP_RELAY.86 194.31,95.25 PUMP_PWR.2A | CLUTCH_RELAY.86 161.29,101.6 D5.C | CLUTCH_RELAY.86 151.13,102.43 CLUTCH_PWR.2A | D14.C 128.27,101.6 DIGITAL_IN1.86 118.11,102.43 DIG1_GND.2A | D13.C 97.79,94.81 DIGITAL_IN2.86 95.25,96.52 DIG2_GND.2A | D11.C 29.21,101.6 DIGITAL_IN4.86 19.05,102.43 DIG4_GND.2A | DIG5_GND.2A 86.36,160.6 90.49,156.46 90.68,156.46 96.01,151.13 96.01,149.93 DIGITAL_IN5.86 96.52,158.75 D10.C | D9.C 63.5,158.75 DIGITAL_IN6.86 63.18,149.42 52.09,160.5 52.09,162.53 DIG6_GND.2A | D8.C 30.48,158.75 DIGITAL_IN7.86 20.32,159.58 DIG7_GND.2A | D6.C 129.54,158.75 FAN_RELAY.86 129.54,150.44 119.38,160.6 FAN_PWR.2A | D15.C 162.56,158.75 RUNNING_LIGHT.86 162.56,150.29 152.4,160.45 RUN_LIGHT_PWR.2A | R_HEAD_PWR.2A 185.42,160.34 195.58,150.18 R_HEADLIGHT.86 195.58,158.75 D19.C | D16.C 228.6,158.75 L_HEADLIGHT.86 228.6,150.18 218.44,160.34 L_HEAD_PWR.2A | D18.C 261.62,158.75 R_TAILLIGHT.86 261.62,150.44 251.46,160.6 R_TAIL_PWR.2A | D17.C 295.91,158.75 L_TAILLIGHT.86 295.91,150.69 285.75,160.85 L_TAIL_PWR.2A | RELAY_COIL_FUSE.1 321.92,119.81 331.9,109.83 331.9,97.78 INTERLOCK_RELAY.86 | CLUTCH_RELAY.86 168.05,99.03 168.05,107.59 170.66,110.21 176.37,110.21 PUMP_RELAY.86
  Bottom 0.254: LA-_RELAY.86 255.71,92.27 242.06,105.92 234.44,105.92 230.38,101.85 230.38,94.49 228.25,92.36 227.42,92.36 | D12.C 62.23,101.6 DIGITAL_IN3.86 52.07,102.43 DIG3_GND.2A
ACC_IN
  Bottom 2.418: HARNESS2.11 288.72,34.87 282.47,34.87 280.52,32.92 280.52,18.82 294.06,5.28 376.4,5.28 397.58,26.46 397.58,50.55 399.76,52.73 399.76,63.93 392.37,71.32 349.66,71.32 346.4,68.07 ACCESSORY_PWR_FUSE.1 351.18,67.59 391.06,67.59 396.42,62.23 396.42,53.39 394,50.98 394,27.74 374.68,8.41 296.44,8.41 284.02,20.83 284.02,29.11 286.66,31.75 HARNESS2.12
ACC_OUT
  Bottom 0.254: HARNESS1.3 359.64,38.2
  Bottom 2.418: 359.64,38.2 359.64,62.58 ACCESSORY_PWR_FUSE.3 360.71,61.97 360.93,61.97 363.73,59.18 HARNESS1.4
BRAKE
  Bottom 0.254: BRAKE_FUSE.1 284.1,63.76
  Bottom 6.299: BRAKE_RELAY.30 302.32,83.25 306.09,79.48 306.09,75.16 301.32,70.39 295.43,70.39 288.8,63.76 284.1,63.76
BRAKE_CTRL
  Top 0.254: BRAKE_RELAY.85 288.2,80.53 288.2,80.54 287.92,80.82 187.71,80.82 176.91,70.03 176.91,42.42 173.23,38.73 CONTROL2.4
  Bottom 0.254: BRAKE_RELAY.85 296.34,78.34 296.34,88.16 304.8,96.62 D4.A R9.2
BRAKE_OUT
  Top 2.418: HARNESS1.11 355.35,32.99 353.11,35.23 349,35.23 340.13,44.09 316.35,44.09 298.63,61.82 298.4,61.82 BRAKE_FUSE.3 296.73,61.82 296.5,61.82 295,60.32 295,57.9 294.97,57.86 321.08,31.75 HARNESS1.12
CLUTCH
  Bottom 0.254: CLUTCH_FUSE.1 152.02,63.76
  Bottom 6.299: CLUTCH_RELAY.30 170.24,83.25 174.01,79.48 174.01,75.16 169.24,70.39 158.65,70.39 152.02,63.76
CLUTCH_CTRL
  Top 0.254: CLUTCH_RELAY.85 174.65,62.01 174.65,43.71 CONTROL2.3
  Bottom 0.254: R8.2 D5.A 172.72,95.96 165.15,88.39 165.15,79.23 CLUTCH_RELAY.85
CLUTCH_OUT
  Top 2.418: HARNESS1.6 375.67,38.1 380.24,33.53 380.24,20.4 367.89,8.05 159.18,8.05 147.96,19.28 147.96,45.13 153.52,50.7 159.64,50.7 165.35,56.41 165.35,62.53 CLUTCH_FUSE.3 164.51,62.66 156.67,54.81 151.61,54.81 143.33,46.53 143.33,18.34 157.38,4.29 373.99,4.29 385.19,15.49 385.19,35.89 377.9,43.18 373,43.18 HARNESS1.5
DIG1_CTRL
  Top 0.254: DIGITAL_IN1.85 97.16,44.26 CONTROL1.1
  Bottom 0.254: DIGITAL_IN1.85 128.27,79.2 139.7,90.63 D14.A R3.2
DIG2_CTRL
  Bottom 0.254: R4.2 D13.A 107.95,92.51 95.25,79.81 DIGITAL_IN2.85 101.35,69.27 CONTROL1.2
DIG3_CTRL
  Bottom 0.254: R5.2 D12.A 73.69,102.84 73.69,91.67 62.23,80.21 DIGITAL_IN3.85 63.56,76.7 63.56,79.75 70.06,86.26 72.52,86.26 74.84,83.94 74.84,77.49 95,57.33 95,37.64 97.26,35.38 102.82,35.38 CONTROL1.3
DIG4_CTRL
  Bottom 0.254: R6.2 D11.A 40.64,90.12 29.21,78.69 DIGITAL_IN4.85 29.21,35.23 30.99,33.45 105.08,33.45 CONTROL1.4
DIG5_CTRL
  Bottom 0.254: R2.2 D10.A 109.09,158.88 109.09,139.88 106.41,137.19 101.19,137.19 DIGITAL_IN5.85 96.52,132.36 113.98,114.9 113.98,38.04 CONTROL1.5
DIG6_CTRL
  Bottom 0.254: R1.2 D9.A 75.79,159.16 75.79,140.44 72.82,137.47 68.44,137.47 63.62,132.64 | 63.62,132.64 DIGITAL_IN6.85 | 63.62,132.64 69.73,132.64 76.17,126.19 99.69,126.19 111.61,114.28 111.61,38.37 113.72,36.25 116.26,36.25 CONTROL1.6
DIG7_CTRL
  Bottom 0.254: R19.2 D8.A 41.91,148.06 30.48,136.63 DIGITAL_IN7.85 9.32,111.36 9.32,26.75 15.37,20.7 118.95,20.7 121.54,23.29 121.54,28.32 CONTROL1.7
DIG_IN1
  Top 0.254: DIGITAL_IN1.30 131.41,78.01 127,78.01 84.38,35.39 35.03,35.39 33.66,36.77 SEVCON.1
DIG_IN2
  Top 0.254: DIGITAL_IN2.30 99.16,78.78 99.16,75.09 60.5,36.43 39.2,36.43 37.85,37.78 SEVCON.2
DIG_IN3
  Bottom 0.254: DIGITAL_IN3.30 71.92,83.08 71.92,53.23 54.74,36.05 49.74,36.05 48.18,37.6 48.18,40.13 47.57,40.74 43.16,40.74 42.04,39.62 SEVCON.3
DIG_IN4
  Bottom 0.254: SEVCON.4 45.82,38.1 42.29,34.57 32.82,34.57 31.62,35.76 31.62,36.14 31.62,36.27 31.62,76.75 38.16,83.29 DIGITAL_IN4.30
DIG_IN5
  Bottom 0.254: DIGITAL_IN5.30 98.98,147.46 95.71,147.46 78.66,164.51 78.66,167.72 77.22,169.16 48.35,169.16 47.9,168.09 47.9,42.49 50.42,39.98 SEVCON.5
DIG_IN6
  Bottom 0.254: DIGITAL_IN6.30 66.65,140.97 49.61,123.93 49.61,43.1 SEVCON.6
DIG_IN7
  Bottom 0.254: SEVCON.7 51.79,28.93 13.97,28.93 10.72,32.18 10.72,109.05 34.86,133.19 34.86,136.4 DIGITAL_IN7.30
FAN_CTRL  (via drill 0.35)
  Top 0.254: CONTROL2.12 160.66,33.96 v151.54,43.08
  Bottom 0.254: R7.2 140.97,160.17 | 140.97,160.17 D6.A | 140.97,160.17 141,160.15 141,148.34 129.54,136.88 FAN_RELAY.85 116.15,119.13 116.15,46.89 119.96,43.08 v151.54,43.08
FANS
  Bottom 1.397: FAN_RELAY.30 138.49,139.83 134.28,135.62 134.28,130.9 123.19,119.81 FAN_FUSE.1
FANS_OUT
  Bottom 1.397: HARNESS2.1 279.63,38.1 276.07,34.54 276.07,10.64 271.58,6.15 172.61,6.15 155.47,23.28 155.47,45.82 143.66,57.63 143.66,109.88 FAN_FUSE.3
GND
  pour Bottom: 0,0 0,171.2 405.13,171.2 405.13,0
INT_CTRL
  Top 0.254: INTERLOCK_RELAY.85 323.99,72.97 209.86,72.97 209.32,72.44 209.32,32.59 206.28,29.55 170.72,29.55 169.04,31.23 CONTROL2.10
  Bottom 0.152: 327.27,74.49 INTERLOCK_RELAY.85
  Bottom 0.254: R12.1 338.07,103.12 D1.A 337.82,77.65 334.66,74.49 327.27,74.49
INT_IN
  Top 0.254: HARNESS3/PWR.1 224.49,38.1
  Top 2.418: 224.49,38.1 224.49,46.2 221.34,49.35 216.97,49.35 212.01,54.3 212.01,65.73 216.74,70.46 326.54,70.46 330.42,74.34 330.42,80.04 334.2,83.82 INTERLOCK_RELAY.30 335.34,83.07 337.17,81.24 337.17,71 333.15,66.98 332.97,67.16 231.29,67.16 228.35,64.21 HARNESS3/PWR.2
INT_OUT
  Bottom 0.254: HARNESS1.2 355.44,38.19
  Bottom 2.418: 355.44,38.19 355.44,45.49 348.12,52.8 331.39,52.8 321.54,62.66 INTERLOCK_FUSE.1 330.74,49.03 346.34,49.03 351.16,44.22 HARNESS1.1
INTERLOCK
  Bottom 0.254: INTERLOCK_FUSE.3 330.1,63.15 330.1,63.76
  Bottom 6.299: INTERLOCK_RELAY.87 317.44,76.42 330.1,63.76
LA+
  Bottom 3.607: LA+_RELAY.30 236.28,81.34 238.7,78.92 238.7,75.72 236.43,73.45 233.12,73.45 222.32,62.66 LA+_FUSE.1
LA+_CTRL
  Top 0.254: R11.2 D2.A
  Bottom 0.254: D2.A 232.16,96.27 232.16,80.2 LA+_RELAY.85 204.78,75.37 184.4,54.99 184.4,40.89 CONTROL2.6
LA+_OUT
  Top 1.397: HARNESS1.8 366.57,30.4 366.57,21.08 359.56,14.07 277.27,14.07 272.06,19.28 272.06,29.49 238.89,62.66 LA+_FUSE.3 268.48,25.71 268.48,18.26 275.21,11.53 363.45,11.53 376.83,24.92 376.83,27.03 HARNESS1.7
LA-
  Bottom 3.607: LA-_RELAY.30 269.3,81.34 271.72,78.92 271.72,75.72 269.45,73.45 266.21,73.45 255.42,62.66 LA-_FUSE.1
LA-_CTRL
  Bottom 0.254: R10.2 D3.A 266.19,97.28 266.19,81.21 LA-_RELAY.85 237.77,52.79 213.78,52.79 201.4,65.18 196.16,65.18 187.81,56.82 187.81,35 184.56,31.75 CONTROL2.7
LA-_OUT
  Top 1.397: HARNESS1.10 359.56,31.73 359.56,21.39 357.56,19.38 286.44,19.38 282.25,23.57 282.25,45.18 265.61,61.82 265.38,61.82 LA-_FUSE.3 263.71,61.82 263.48,61.82 261.47,59.8 261.47,55.32 277.8,38.99 277.8,21.39 282.7,16.48 358.39,16.48 363.73,21.82 HARNESS1.9
LH_LIGHT
  Bottom 0.254: L_HEADLIGHT.30 237.55,139.02 233.91,135.38 233.91,132.1 221.61,119.81 L_HEADLIGHT_FUSE.1
LHL_CTRL
  Bottom 0.254: R14.2 D16.A 240.03,148.59 228.6,137.16 L_HEADLIGHT.85 224.99,136.13 224.99,151.49 208.48,168 149.4,168 146.58,165.17 146.58,58.3 160.66,44.22 CONTROL2.1
LHL_OUT
  Bottom 0.254: L_HEADLIGHT_FUSE.3 239.98,119.81 247.17,112.62 304.62,112.62 310.36,106.88 310.36,48.16 300.3,38.1 HARNESS2.4
LT_LIGHT
  Bottom 0.254: L_TAILLIGHT.30 304.86,139.02 301.22,135.38 301.22,132.97 288.06,119.81 L_TAILLIGHT_FUSE.1
LTL_CTRL  (via drill 0.35)
  Top 0.254: CONTROL2.9 175.36,33.88 207.39,33.88 208.08,34.57 208.08,76.81 v208.05,76.83 208.05,76.63 | L_TAILLIGHT.85 287.34,123.95 245.72,123.95 245.72,87.78 244.47,86.54 v212.5,86.54
  Bottom 0.254: R15.2 D17.A 307.34,146.22 302.9,141.78 302.9,138.59 296.65,132.33 296.1,132.33 L_TAILLIGHT.85 | v212.5,86.54 212.5,80.62 208.71,76.83 v208.05,76.83
LTL_OUT
  Bottom 0.254: HARNESS2.6 308.61,41.27 312.61,45.28 312.61,107.3 L_TAILLIGHT_FUSE.3
N$2
  Bottom 0.254: R19.1 29.21,162.56 DIG7_GND.1A
N$4
  Bottom 0.254: R2.1 95.25,162.56 DIG5_GND.1A
N$5
  Bottom 0.254: R3.1 127,105.41 DIG1_GND.1A
N$6
  Bottom 0.254: R4.1 95.25,105.41 DIG2_GND.1A
N$7
  Bottom 0.254: R5.1 60.96,105.41 DIG3_GND.1A
N$8
  Bottom 0.254: R6.1 27.94,105.41 DIG4_GND.1A
N$9
  Bottom 0.254: FAN_PWR.1A 128.27,162.56 R7.1
N$10
  Bottom 0.254: CLUTCH_PWR.1A 156.21,107.95 R8.1
N$11
  Bottom 0.254: BRAKE_PWR.1A 288.29,107.95 R9.1
N$12
  Bottom 0.254: R10.1 259.08,105.41 LA-_PWR.1A
N$13
  Bottom 0.254: R11.1 226.06,105.41 LA+_PWR.1A
N$14
  Bottom 0.254: INTERLOCK_PWR.1A 321.26,107.9 R12.2
N$15
  Bottom 0.254: R13.1 193.04,105.41 PUMP_PWR.1A
N$16
  Bottom 0.254: L_HEAD_PWR.1A 227.33,162.56 R14.1
N$17
  Bottom 0.254: L_TAIL_PWR.1A 290.83,165.1 R15.1
N$19
  Bottom 0.254: R_HEAD_PWR.1A 194.31,162.56 R17.1
N$33
  Bottom 0.254: R_TAIL_PWR.1A 256.54,165.1 R16.1
N$34
  Bottom 0.254: R18.1 161.29,162.56 RUN_LIGHT_PWR.1A
N$36
  Bottom 0.254: DIG6_GND.1A 57.15,165.1 R1.1
PUMP
  Bottom 1.397: PUMP_RELAY.30 203.26,82.68 199.05,78.47 199.05,73.72 187.98,62.66 PUMP_FUSE.1
PUMP_CTRL
  Top 0.254: PUMP_RELAY.85 189.59,75.37 181.13,66.9 181.13,41.81 CONTROL2.5
  Bottom 0.254: PUMP_RELAY.85 197.18,78.24 197.18,86.84 205.74,95.4 D7.A R13.2
PUMP_OUT
  Bottom 1.397: HARNESS2.2 283.82,46.13 215.04,46.13 PUMP_FUSE.3
RH_LIGHT
  Bottom 0.254: R_HEADLIGHT.30 204.53,139.02 200.89,135.38 200.89,132.26 188.44,119.81 R_HEADLIGHT_FUSE.1
RHL_CTRL
  Bottom 0.254: R17.2 D19.A 207.01,149.25 195.58,137.82 195.58,132.79 | R_HEADLIGHT.85 195.58,132.79 | 195.58,132.79 191.99,136.38 191.99,150.65 181.13,161.51 181.13,166.6 180.82,166.9 150.34,166.9 148.08,164.64 148.08,59.17 151.71,55.55 155.78,55.55 164.85,46.48 CONTROL2.2
RHL_OUT
  Bottom 0.254: HARNESS2.3 278.64,55.5 278.64,110.54 277.29,111.89 208.16,111.89 200.32,119.73 199.85,119.73 R_HEADLIGHT_FUSE.3
RN_LIGHT
  Bottom 0.254: RUNNING_LIGHT.30 171.51,139.02 167.87,135.38 167.87,132.26 155.42,119.81 RUNNING_LIGHT_FUSE.1
RT_LIGHT
  Bottom 0.254: R_TAILLIGHT.30 270.57,139.02 266.93,135.38 266.93,132.18 254.56,119.81 R_TAILLIGHT_FUSE.1
RTL_CTRL  (via drill 0.35)
  Top 0.254: R_TAILLIGHT.85 254.81,125.7 244.7,125.7 244.3,125.3 244.3,89.43 242.86,88 212.48,88 212.47,88.01 v212.34,88.01 | CONTROL2.11 168.22,35.13 206.48,35.13 206.81,35.46 v206.81,76.81
  Bottom 0.254: R16.2 D18.A 273.05,148.44 261.62,137.01 R_TAILLIGHT.85 | v212.34,88.01 v212.34,88.02 210.8,86.48 210.8,80.8 v206.81,76.81
RTL_OUT
  Bottom 0.254: HARNESS2.5 304.42,38.81 311.51,45.9 311.51,107.1 304.87,113.73 280.33,113.73 274.26,119.81 R_TAILLIGHT_FUSE.3
RUNL_CTRL  (via drill 0.35)
  Top 0.254: 176.2,105.46 v176.2,105.54 176.2,118.88 RUNNING_LIGHT.85
  Bottom 0.254: RUNNING_LIGHT.85 162.56,136.65 174.02,148.11 174.02,160 D15.A R18.2 | v176.2,105.54 176.2,103.02 178.96,100.26 178.96,35.92 177.42,34.38 CONTROL2.8
RUNL_OUT
  Bottom 0.254: RUNNING_LIGHT_FUSE.3 174.32,119.81 183.36,110.77 276.17,110.77 277.04,109.91 277.04,101.07 277.05,101.08 277.05,55.14 296.09,36.1 302.17,36.1 306.52,31.75 HARNESS2.7
SEAT_OUT
  Bottom 2.083: HARNESS2.10 294.49,30.2 294.49,15.75 298.4,11.84 373.69,11.84 390.61,28.75 390.61,53.62 393.25,56.26 393.25,59.61 SEAT_FUSE.3 | HARNESS2.9 298.12,29.64 298.12,18.88 301.7,15.3 372.79,15.3 387.67,30.18 387.67,55.98 390.02,58.33 SEAT_FUSE.3 | HARNESS2.8 301.73,29.06 301.73,21.42 304.55,18.6 371.95,18.6 384.65,31.3 384.65,57.47 SEAT_FUSE.3

### Text on the board
tPlace: FUSE VALUES | Accessory Power: / Interlock: / Seat: / Fan: / Pump: / LA+: / LA-: / Brake: / Clutch: / R Headlight: / L Headlight: / R Taillight: / L Taillight: / Running Lights: | 15A / 15A / 20A / 5A / 5A / 10A / 10A / 15A / 15A / 1A / 1A / 1A / 1A / 1A | P7: Digital In 7 / P9, P10: NC / P11, P12: NC | P9: NC / P10: NC / P11: NC / P12: NC | P9: L Taillight Ctrl / P10: Interlock Ctrl / P11: R Taillight Ctrl / P12: Fan Ctrl | P7: Running Light Out / P8, P9, P10: Seat Out / P11, P12: Accessory Pwr In
tNames: Katherine Gledson / UofM Association of Tiny Tractors (UMATT) / P20 Relay Board V1 | P1: Digital In 1 / P2: Digital In 2 / P3: Digital In 3 | P4: Digital In 4 / P5: Digital In 5 / P6: Digital In 6 | P1: Digital In 1 Ctrl / P2: Digital In 2 Ctrl / P3: Digital In 3 Ctrl / P4: Digital In 4 Ctrl | P5: Digital In 5 Ctrl / P6: Digital In 6 Ctrl / P7: Digital In 7 Ctrl / P8: Ctrl Board 12V | P1: L Headlight Ctrl / P2: R Headlight Ctrl / P3: Clutch Ctrl / P4: Brake Ctrl | P5: Pump Ctrl / P6: LA+ Ctrl / P7: LA- Ctrl / P8: Running Light Ctrl | P1, P2: Interlock In / P3, P4: GND / P5: NC / P6, P7, P8, P9, P10, P11, P12: 12V | P1: Fan Out / P2: Pump Out / P3: R Headlight Out | P4: L Headlight Out / P5: R Taillight Out / P6: L Taillight Out | P1, P2: Interlock Out / P3, P4: Accessory Pwr Out / P5, P6: Clutch Out | P7, P8: LA+ Out / P9, P10: LA- Out / P11, P12: Brake Out